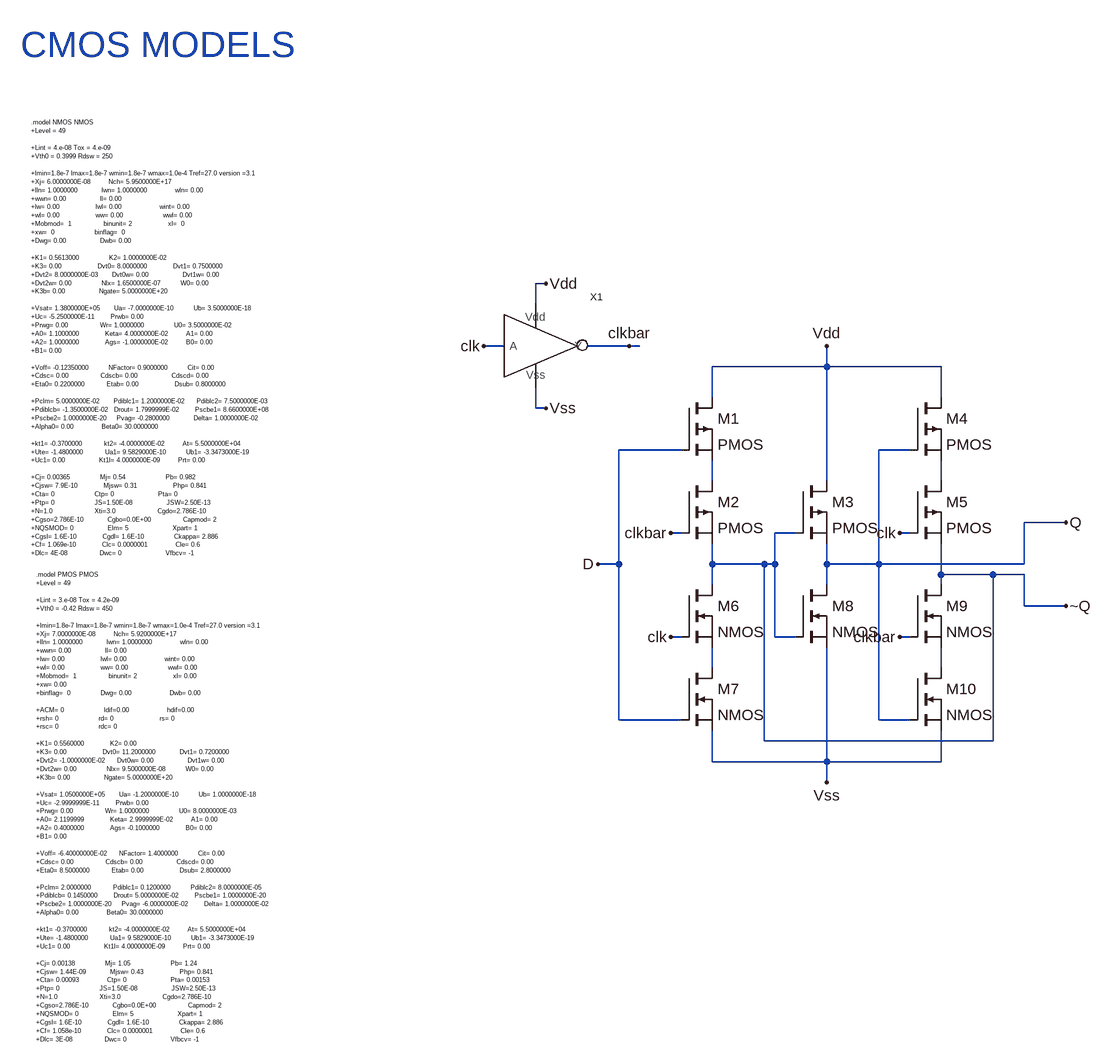
[diagram p0: schematic D_FF_cmos.asc]
D_FF_cmos.asc, the LTspice schematic file:
Version 4
SHEET 1 2036 884
WIRE 576 -256 560 -256
WIRE 560 -224 560 -256
WIRE 512 -160 480 -160
WIRE 704 -160 640 -160
WIRE 720 -160 704 -160
WIRE 1008 -128 1008 -160
WIRE 1008 -128 832 -128
WIRE 1184 -128 1008 -128
WIRE 832 -80 832 -128
WIRE 1184 -80 1184 -128
WIRE 560 -64 560 -96
WIRE 576 -64 560 -64
WIRE 784 0 688 0
WIRE 1136 0 1088 0
WIRE 832 48 832 16
WIRE 1008 48 1008 -128
WIRE 1184 48 1184 16
WIRE 1376 112 1312 112
WIRE 784 128 768 128
WIRE 960 128 928 128
WIRE 1136 128 1120 128
WIRE 688 176 688 0
WIRE 688 176 656 176
WIRE 832 176 832 144
WIRE 912 176 832 176
WIRE 928 176 928 128
WIRE 928 176 912 176
WIRE 1008 176 1008 144
WIRE 1088 176 1088 0
WIRE 1088 176 1008 176
WIRE 1312 176 1312 112
WIRE 1312 176 1088 176
WIRE 1184 192 1184 144
WIRE 1264 192 1184 192
WIRE 1312 192 1264 192
WIRE 832 208 832 176
WIRE 1008 208 1008 176
WIRE 1184 208 1184 192
WIRE 1312 240 1312 192
WIRE 1376 240 1312 240
WIRE 784 288 768 288
WIRE 928 288 928 176
WIRE 960 288 928 288
WIRE 1136 288 1120 288
WIRE 832 336 832 304
WIRE 1184 336 1184 304
WIRE 688 416 688 176
WIRE 784 416 688 416
WIRE 1088 416 1088 176
WIRE 1136 416 1088 416
WIRE 912 448 912 176
WIRE 1264 448 1264 192
WIRE 1264 448 912 448
WIRE 832 480 832 432
WIRE 1008 480 1008 304
WIRE 1008 480 832 480
WIRE 1184 480 1184 432
WIRE 1184 480 1008 480
WIRE 1008 512 1008 480
FLAG 768 288 clk
FLAG 1120 128 clk
FLAG 768 128 clkbar
FLAG 1120 288 clkbar
FLAG 656 176 D
FLAG 1008 -160 Vdd
FLAG 1376 112 Q
FLAG 1376 240 ~Q
FLAG 480 -160 clk
FLAG 704 -160 clkbar
FLAG 576 -256 Vdd
FLAG 576 -64 Vss
FLAG 1008 512 Vss
SYMBOL pmos 784 -80 R0
SYMATTR InstName M1
SYMBOL pmos 784 48 R0
SYMATTR InstName M2
SYMBOL pmos 960 48 R0
SYMATTR InstName M3
SYMBOL nmos 784 208 R0
SYMATTR InstName M6
SYMBOL nmos 784 336 R0
SYMATTR InstName M7
SYMBOL nmos 960 208 R0
SYMATTR InstName M8
SYMBOL pmos 1136 -80 R0
SYMATTR InstName M4
SYMBOL pmos 1136 48 R0
SYMATTR InstName M5
SYMBOL nmos 1136 208 R0
SYMATTR InstName M9
SYMBOL nmos 1136 336 R0
SYMATTR InstName M10
SYMBOL not 544 -160 R0
SYMATTR InstName X1
TEXT -216 -504 Left 0 !.model NMOS NMOS\n+Level = 49\n \n+Lint = 4.e-08 Tox = 4.e-09 \n+Vth0 = 0.3999 Rdsw = 250 \n \n+lmin=1.8e-7 lmax=1.8e-7 wmin=1.8e-7 wmax=1.0e-4 Tref=27.0 version =3.1\n+Xj= 6.0000000E-08         Nch= 5.9500000E+17 \n+lln= 1.0000000            lwn= 1.0000000              wln= 0.00\n+wwn= 0.00                 ll= 0.00\n+lw= 0.00                  lwl= 0.00                   wint= 0.00\n+wl= 0.00                  ww= 0.00                    wwl= 0.00\n+Mobmod=  1                binunit= 2                  xl=  0\n+xw=  0                    binflag=  0\n+Dwg= 0.00                 Dwb= 0.00 \n \n+K1= 0.5613000               K2= 1.0000000E-02 \n+K3= 0.00                  Dvt0= 8.0000000             Dvt1= 0.7500000 \n+Dvt2= 8.0000000E-03       Dvt0w= 0.00                 Dvt1w= 0.00 \n+Dvt2w= 0.00               Nlx= 1.6500000E-07          W0= 0.00 \n+K3b= 0.00                 Ngate= 5.0000000E+20 \n \n+Vsat= 1.3800000E+05       Ua= -7.0000000E-10          Ub= 3.5000000E-18 \n+Uc= -5.2500000E-11        Prwb= 0.00 \n+Prwg= 0.00                Wr= 1.0000000               U0= 3.5000000E-02 \n+A0= 1.1000000             Keta= 4.0000000E-02         A1= 0.00 \n+A2= 1.0000000             Ags= -1.0000000E-02         B0= 0.00 \n+B1= 0.00 \n \n+Voff= -0.12350000          NFactor= 0.9000000          Cit= 0.00 \n+Cdsc= 0.00                Cdscb= 0.00                 Cdscd= 0.00 \n+Eta0= 0.2200000           Etab= 0.00                  Dsub= 0.8000000 \n \n+Pclm= 5.0000000E-02       Pdiblc1= 1.2000000E-02      Pdiblc2= 7.5000000E-03 \n+Pdiblcb= -1.3500000E-02   Drout= 1.7999999E-02        Pscbe1= 8.6600000E+08 \n+Pscbe2= 1.0000000E-20     Pvag= -0.2800000            Delta= 1.0000000E-02 \n+Alpha0= 0.00              Beta0= 30.0000000 \n \n+kt1= -0.3700000           kt2= -4.0000000E-02         At= 5.5000000E+04 \n+Ute= -1.4800000           Ua1= 9.5829000E-10          Ub1= -3.3473000E-19 \n+Uc1= 0.00                 Kt1l= 4.0000000E-09         Prt= 0.00 \n \n+Cj= 0.00365               Mj= 0.54                    Pb= 0.982\n+Cjsw= 7.9E-10             Mjsw= 0.31                  Php= 0.841\n+Cta= 0                    Ctp= 0                      Pta= 0\n+Ptp= 0                    JS=1.50E-08                 JSW=2.50E-13\n+N=1.0                     Xti=3.0                     Cgdo=2.786E-10\n+Cgso=2.786E-10            Cgbo=0.0E+00                Capmod= 2\n+NQSMOD= 0                 Elm= 5                      Xpart= 1\n+Cgsl= 1.6E-10             Cgdl= 1.6E-10               Ckappa= 2.886\n+Cf= 1.069e-10             Clc= 0.0000001              Cle= 0.6\n+Dlc= 4E-08                Dwc= 0                      Vfbcv= -1
TEXT -208 192 Left 0 !.model PMOS PMOS\n+Level = 49\n \n+Lint = 3.e-08 Tox = 4.2e-09 \n+Vth0 = -0.42 Rdsw = 450 \n \n+lmin=1.8e-7 lmax=1.8e-7 wmin=1.8e-7 wmax=1.0e-4 Tref=27.0 version =3.1\n+Xj= 7.0000000E-08         Nch= 5.9200000E+17 \n+lln= 1.0000000            lwn= 1.0000000              wln= 0.00\n+wwn= 0.00                 ll= 0.00\n+lw= 0.00                  lwl= 0.00                   wint= 0.00\n+wl= 0.00                  ww= 0.00                    wwl= 0.00\n+Mobmod=  1                binunit= 2                  xl= 0.00\n+xw= 0.00                  \n+binflag=  0               Dwg= 0.00                   Dwb= 0.00 \n \n+ACM= 0                    ldif=0.00                   hdif=0.00\n+rsh= 0                    rd= 0                       rs= 0\n+rsc= 0                    rdc= 0\n \n+K1= 0.5560000             K2= 0.00 \n+K3= 0.00                  Dvt0= 11.2000000            Dvt1= 0.7200000 \n+Dvt2= -1.0000000E-02      Dvt0w= 0.00                 Dvt1w= 0.00 \n+Dvt2w= 0.00               Nlx= 9.5000000E-08          W0= 0.00 \n+K3b= 0.00                 Ngate= 5.0000000E+20 \n \n+Vsat= 1.0500000E+05       Ua= -1.2000000E-10          Ub= 1.0000000E-18 \n+Uc= -2.9999999E-11        Prwb= 0.00 \n+Prwg= 0.00                Wr= 1.0000000               U0= 8.0000000E-03 \n+A0= 2.1199999             Keta= 2.9999999E-02         A1= 0.00 \n+A2= 0.4000000             Ags= -0.1000000             B0= 0.00 \n+B1= 0.00 \n \n+Voff= -6.40000000E-02      NFactor= 1.4000000          Cit= 0.00 \n+Cdsc= 0.00                Cdscb= 0.00                 Cdscd= 0.00 \n+Eta0= 8.5000000           Etab= 0.00                  Dsub= 2.8000000 \n \n+Pclm= 2.0000000           Pdiblc1= 0.1200000          Pdiblc2= 8.0000000E-05 \n+Pdiblcb= 0.1450000        Drout= 5.0000000E-02        Pscbe1= 1.0000000E-20 \n+Pscbe2= 1.0000000E-20     Pvag= -6.0000000E-02        Delta= 1.0000000E-02 \n+Alpha0= 0.00              Beta0= 30.0000000 \n \n+kt1= -0.3700000           kt2= -4.0000000E-02         At= 5.5000000E+04 \n+Ute= -1.4800000           Ua1= 9.5829000E-10          Ub1= -3.3473000E-19 \n+Uc1= 0.00                 Kt1l= 4.0000000E-09         Prt= 0.00 \n \n+Cj= 0.00138               Mj= 1.05                    Pb= 1.24\n+Cjsw= 1.44E-09            Mjsw= 0.43                  Php= 0.841\n+Cta= 0.00093              Ctp= 0                      Pta= 0.00153\n+Ptp= 0                    JS=1.50E-08                 JSW=2.50E-13\n+N=1.0                     Xti=3.0                     Cgdo=2.786E-10\n+Cgso=2.786E-10            Cgbo=0.0E+00                Capmod= 2\n+NQSMOD= 0                 Elm= 5                      Xpart= 1\n+Cgsl= 1.6E-10             Cgdl= 1.6E-10               Ckappa= 2.886\n+Cf= 1.058e-10             Clc= 0.0000001              Cle= 0.6\n+Dlc= 3E-08                Dwc= 0                      Vfbcv= -1
TEXT -232 -624 Left 5 ;CMOS MODELS

The netlist it stands for:
* D_FF_cmos.asc
M1 Vdd D N001 N001 PMOS
M2 N001 clkbar ~Q ~Q PMOS
M3 Vdd ~Q Q Q PMOS
M6 ~Q clk N003 N003 NMOS
M7 N003 D Vss Vss NMOS
M8 Q ~Q Vss Vss NMOS
M4 Vdd Q N002 N002 PMOS
M5 N002 clk ~Q ~Q PMOS
M9 ~Q clkbar N004 N004 NMOS
M10 N004 Q Vss Vss NMOS
XX1 clkbar clk Vdd Vss not  ; pins Y A Vdd Vss
.model NMOS NMOS
.model PMOS PMOS
.lib standard.mos
.model NMOS NMOS
+Level = 49
+Lint = 4.e-08 Tox = 4.e-09
+Vth0 = 0.3999 Rdsw = 250
+lmin=1.8e-7 lmax=1.8e-7 wmin=1.8e-7 wmax=1.0e-4 Tref=27.0 version =3.1
+Xj= 6.0000000E-08         Nch= 5.9500000E+17
+lln= 1.0000000            lwn= 1.0000000              wln= 0.00
+wwn= 0.00                 ll= 0.00
+lw= 0.00                  lwl= 0.00                   wint= 0.00
+wl= 0.00                  ww= 0.00                    wwl= 0.00
+Mobmod=  1                binunit= 2                  xl=  0
+xw=  0                    binflag=  0
+Dwg= 0.00                 Dwb= 0.00
+K1= 0.5613000               K2= 1.0000000E-02
+K3= 0.00                  Dvt0= 8.0000000             Dvt1= 0.7500000
+Dvt2= 8.0000000E-03       Dvt0w= 0.00                 Dvt1w= 0.00
+Dvt2w= 0.00               Nlx= 1.6500000E-07          W0= 0.00
+K3b= 0.00                 Ngate= 5.0000000E+20
+Vsat= 1.3800000E+05       Ua= -7.0000000E-10          Ub= 3.5000000E-18
+Uc= -5.2500000E-11        Prwb= 0.00
+Prwg= 0.00                Wr= 1.0000000               U0= 3.5000000E-02
+A0= 1.1000000             Keta= 4.0000000E-02         A1= 0.00
+A2= 1.0000000             Ags= -1.0000000E-02         B0= 0.00
+B1= 0.00
+Voff= -0.12350000          NFactor= 0.9000000          Cit= 0.00
+Cdsc= 0.00                Cdscb= 0.00                 Cdscd= 0.00
+Eta0= 0.2200000           Etab= 0.00                  Dsub= 0.8000000
+Pclm= 5.0000000E-02       Pdiblc1= 1.2000000E-02      Pdiblc2= 7.5000000E-03
+Pdiblcb= -1.3500000E-02   Drout= 1.7999999E-02        Pscbe1= 8.6600000E+08
+Pscbe2= 1.0000000E-20     Pvag= -0.2800000            Delta= 1.0000000E-02
+Alpha0= 0.00              Beta0= 30.0000000
+kt1= -0.3700000           kt2= -4.0000000E-02         At= 5.5000000E+04
+Ute= -1.4800000           Ua1= 9.5829000E-10          Ub1= -3.3473000E-19
+Uc1= 0.00                 Kt1l= 4.0000000E-09         Prt= 0.00
+Cj= 0.00365               Mj= 0.54                    Pb= 0.982
+Cjsw= 7.9E-10             Mjsw= 0.31                  Php= 0.841
+Cta= 0                    Ctp= 0                      Pta= 0
+Ptp= 0                    JS=1.50E-08                 JSW=2.50E-13
+N=1.0                     Xti=3.0                     Cgdo=2.786E-10
+Cgso=2.786E-10            Cgbo=0.0E+00                Capmod= 2
+NQSMOD= 0                 Elm= 5                      Xpart= 1
+Cgsl= 1.6E-10             Cgdl= 1.6E-10               Ckappa= 2.886
+Cf= 1.069e-10             Clc= 0.0000001              Cle= 0.6
+Dlc= 4E-08                Dwc= 0                      Vfbcv= -1
.model PMOS PMOS
+Level = 49
+Lint = 3.e-08 Tox = 4.2e-09
+Vth0 = -0.42 Rdsw = 450
+lmin=1.8e-7 lmax=1.8e-7 wmin=1.8e-7 wmax=1.0e-4 Tref=27.0 version =3.1
+Xj= 7.0000000E-08         Nch= 5.9200000E+17
+lln= 1.0000000            lwn= 1.0000000              wln= 0.00
+wwn= 0.00                 ll= 0.00
+lw= 0.00                  lwl= 0.00                   wint= 0.00
+wl= 0.00                  ww= 0.00                    wwl= 0.00
+Mobmod=  1                binunit= 2                  xl= 0.00
+xw= 0.00
+binflag=  0               Dwg= 0.00                   Dwb= 0.00
+ACM= 0                    ldif=0.00                   hdif=0.00
+rsh= 0                    rd= 0                       rs= 0
+rsc= 0                    rdc= 0
+K1= 0.5560000             K2= 0.00
+K3= 0.00                  Dvt0= 11.2000000            Dvt1= 0.7200000
+Dvt2= -1.0000000E-02      Dvt0w= 0.00                 Dvt1w= 0.00
+Dvt2w= 0.00               Nlx= 9.5000000E-08          W0= 0.00
+K3b= 0.00                 Ngate= 5.0000000E+20
+Vsat= 1.0500000E+05       Ua= -1.2000000E-10          Ub= 1.0000000E-18
+Uc= -2.9999999E-11        Prwb= 0.00
+Prwg= 0.00                Wr= 1.0000000               U0= 8.0000000E-03
+A0= 2.1199999             Keta= 2.9999999E-02         A1= 0.00
+A2= 0.4000000             Ags= -0.1000000             B0= 0.00
+B1= 0.00
+Voff= -6.40000000E-02      NFactor= 1.4000000          Cit= 0.00
+Cdsc= 0.00                Cdscb= 0.00                 Cdscd= 0.00
+Eta0= 8.5000000           Etab= 0.00                  Dsub= 2.8000000
+Pclm= 2.0000000           Pdiblc1= 0.1200000          Pdiblc2= 8.0000000E-05
+Pdiblcb= 0.1450000        Drout= 5.0000000E-02        Pscbe1= 1.0000000E-20
+Pscbe2= 1.0000000E-20     Pvag= -6.0000000E-02        Delta= 1.0000000E-02
+Alpha0= 0.00              Beta0= 30.0000000
+kt1= -0.3700000           kt2= -4.0000000E-02         At= 5.5000000E+04
+Ute= -1.4800000           Ua1= 9.5829000E-10          Ub1= -3.3473000E-19
+Uc1= 0.00                 Kt1l= 4.0000000E-09         Prt= 0.00
+Cj= 0.00138               Mj= 1.05                    Pb= 1.24
+Cjsw= 1.44E-09            Mjsw= 0.43                  Php= 0.841
+Cta= 0.00093              Ctp= 0                      Pta= 0.00153
+Ptp= 0                    JS=1.50E-08                 JSW=2.50E-13
+N=1.0                     Xti=3.0                     Cgdo=2.786E-10
+Cgso=2.786E-10            Cgbo=0.0E+00                Capmod= 2
+NQSMOD= 0                 Elm= 5                      Xpart= 1
+Cgsl= 1.6E-10             Cgdl= 1.6E-10               Ckappa= 2.886
+Cf= 1.058e-10             Clc= 0.0000001              Cle= 0.6
+Dlc= 3E-08                Dwc= 0                      Vfbcv= -1
* CMOS MODELS
.backanno
.end